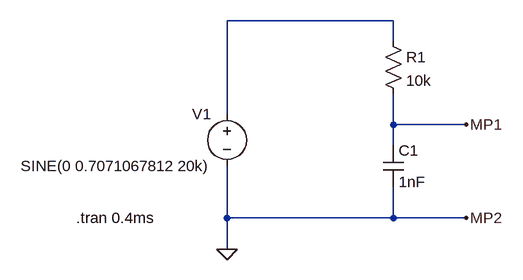
[diagram p0: schematic 2_5SineWithCapacitor_HighpassF.asc]
2_5SineWithCapacitor_HighpassF.asc, the LTspice schematic file:
Version 4
SHEET 1 880 680
WIRE 416 0 160 0
WIRE 416 32 416 0
WIRE 160 144 160 0
WIRE 416 160 416 112
WIRE 528 160 416 160
WIRE 416 192 416 160
WIRE 160 304 160 224
WIRE 416 304 416 256
WIRE 416 304 160 304
WIRE 528 304 416 304
WIRE 160 352 160 304
FLAG 160 352 0
FLAG 528 160 MP1
FLAG 528 304 MP2
SYMBOL voltage 160 128 M0
WINDOW 123 0 0 Left 0
WINDOW 39 0 0 Left 0
SYMATTR InstName V1
SYMATTR Value SINE(0 0.7071067812 20k)
SYMBOL res 400 16 R0
SYMATTR InstName R1
SYMATTR Value 10k
SYMBOL cap 400 192 R0
SYMATTR InstName C1
SYMATTR Value 1nF
TEXT -72 304 Left 2 !.tran 0.4ms

The netlist it stands for:
* 2_5SineWithCapacitor_HighpassF.asc
V1 N001 0 SINE(0 0.7071067812 20k)
R1 N001 MP1 10k
C1 MP1 0 1nF
.tran 0.4ms
.backanno
.end